# Altium schematic sheet ME6209.SchDoc
size A4
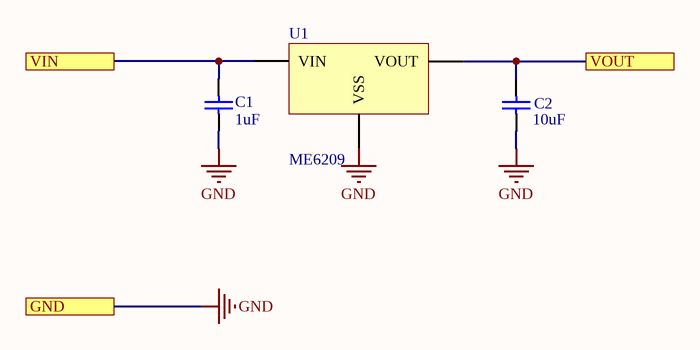
[diagram p0: ME6209.SchDoc]

## Parts
C1  1uF  [LC-0603_C]
C2  10uF  [LC-0603_C]
U1  ME6209  [LC-SOT-23(SOT-23-3) - duplicate]

## Ports
GND, VIN, VOUT

## Nets
GND: C1.1 C2.1 U1.1(VSS) ; port GND
VIN: C1.2 U1.3(VIN) ; port VIN
VOUT: C2.2 U1.2(VOUT) ; port VOUT

## Library data of the parts
C1 = 0603 1uF (105) 10% 50V: 贴片电容; ComponentLink1Description: 供应商链接; ComponentLink1URL: http://www.szlcsc.com/product/details_16531.html; Package: 0603; Supplier: LC; SuppliersPartNumber: C15849
C2 = 0603 10uF (106) 10% 10V: 贴片电容; ComponentLink1Description: 供应商链接; ComponentLink1URL: http://www.szlcsc.com/product/details_20411.html; Package: 0603; Supplier: LC; SuppliersPartNumber: C19702
U1 = ME6209: 低压差线性稳压